# Altium schematic sheet PowerDetector.SchDoc: =ProjectName
size 420 x 297 mm; Author: SBH; CompanyName: WUT; DrawnBy: SBH; Organization: ISE-WUT; Address1: Warsaw Univeristy of Technology; Address2: Nowowiejska 15/19; Revision: -; SheetNumber: -; SheetTotal: -; EDA_Number: ARTIQ; Projet: ADC/DAC MEZZANINE; ModifiedBy: -; CreateDate: XX/XX/XXXX; CheckedDate: -; Title2: PowerDetector.SchDoc; DivGrp: ISE; Designer: SBH; ModifiedDate: -; ProjectName: ADC/DAC MEZZANINE
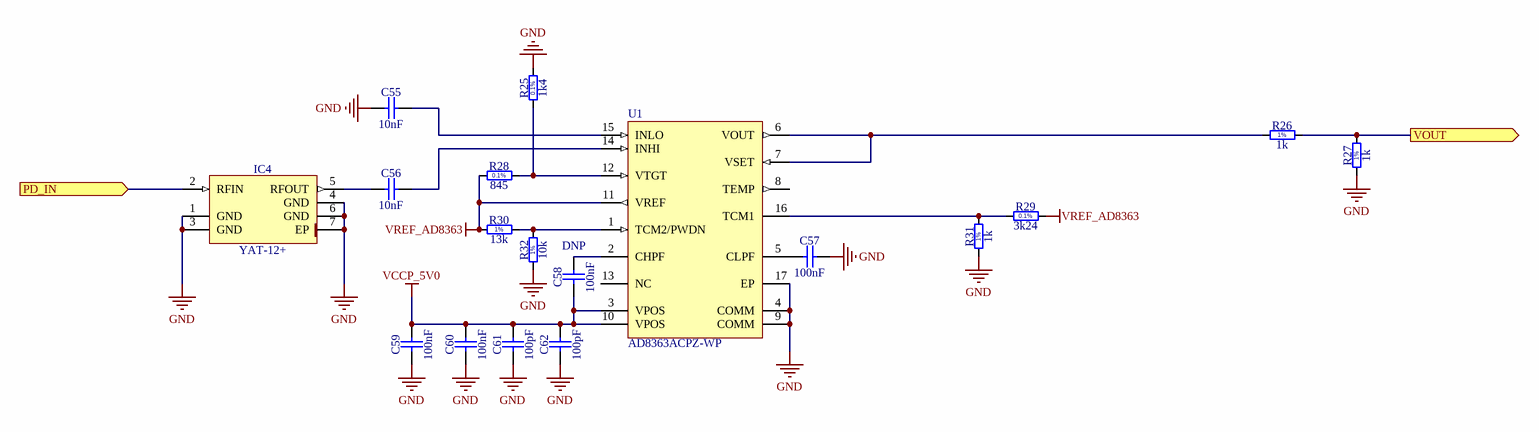
[diagram p0: PowerDetector.SchDoc]

## Parts
C55  10nF  [CAPC1005X55N]
C56  10nF  [CAPC1005X55N]
C57  100nF  [CAPC1005X55N]
C58  100nF  Mounted: DNP  [CAPC1005X55N]
C59  100nF  [CAPC1005X55N]
C60  100nF  [CAPC1005X55N]
C61  100pF  [CAPC1005X55N]
C62  100pF  [CAPC1005X55N]
IC4  YAT-12+  [MINI-CIRCUITS_MC1630]
R25  1k4  [RESC1608X55N]
R26  1k  [RESC1005X40N]
R27  1k  [RESC1005X40N]
R28  845  [RESC1608X55N]
R29  3k24  [RESC1608X55N]
R30  13k  [RESC1005X40N]
R31  1k  [RESC1005X40N]
R32  10k  [RESC1005X40N]
U1  AD8363ACPZ-WP  [ADI-CP-16-10_M]

## Ports
PD_IN (in), VOUT (out)

## Nets
GND: C55.1 C57.2 C59.1 C60.1 C61.2 C62.2 IC4.1(GND) IC4.3(GND) IC4.4(GND) IC4.6(GND) IC4.7(EP) R25.2 R27.1 R31.1 R32.1 U1.4(COMM) U1.9(COMM) U1.17(EP)
VCCP_5V0: C58.1 C59.2 C60.2 C61.1 C62.1 U1.3(VPOS) U1.10(VPOS)
VREF_AD8363: R28.1 R29.2 R30.1 U1.11(VREF)
PD_IN: IC4.2(RFIN) ; port PD_IN
VOUT: R26.2 R27.2 ; port VOUT
NetC55_2: C55.2 U1.15(INLO)
NetC56_1: C56.1 IC4.5(RFOUT)
NetC56_2: C56.2 U1.14(INHI)
NetC57_1: C57.1 U1.5(CLPF)
NetC58_2: C58.2 U1.2(CHPF)
NetR25_1: R25.1 R28.2 U1.12(VTGT)
NetR26_1: R26.1 U1.6(VOUT) U1.7(VSET)
NetR29_1: R29.1 R31.2 U1.16(TCM1)
NetR30_2: R30.2 R32.2 U1.1(TCM2/PWDN)

Not connected (* = marked no-connect by the designer): U1 8(TEMP) 13(NC)

## Notes on the sheet
- Project/Equipment
- Document
- Designer
- Drawn by
- Check.by
- File
- Last Mod.
- Print Date
- Sheet
- Size
- A3
- of
- Rev
- (in symbol R0402_1K_1%_0.0625W_100PPM) 1%
- (in symbol R0402_10K_1%_0.0625W_100PPM) 1%
- (in symbol R0402_13K_1%_0.0625W_100PPM) 1%
- (in symbol R0603_1K4_0.1%_0.063W_10PPM) 0.1%
- (in symbol R0603_3K24_0.1%_0.063W_10PPM) 0.1%
- (in symbol R0603_845R_0.1%_0.063W_10PPM) 0.1%

## Library data of the parts
C55 C56 = CC0402_10NF_16V_10%_X7R: Non-polarised capacitor; Part Description: SMD Multilayer Chip Ceramic Capacitor; Manufacturer: GENERIC; Manufacturer1 Part Number: 223878715636; Voltage: 16V; TC: X7R; Tolerance: ±10%; Part Number: CC0402_10NF_16V_10%_X7R; Component Kind: Standard; Component Type: Standard; Pin Count: 2; Value: 10nF; Status: Not Recommended; Manufacturer Part Number: CC0402_10NF_16V_10%_X7R; Case: 0402; Mounted: Yes; Socket: No; SMD: Yes; Sense: No; Manufacturer1 Example: PHYCOMP; Manufacturer1 ComponentHeight: 0.55mm; HelpURL: \\cern.ch\dfs\Applications\Altium\Datasheets\CC0402_X7R_PHYCOMP.pdf; Author: CERN DEM JLC; CreateDate: 2007-12-03; LatestRevisionDate: 2007-12-03
C57-C60 = CC0402_100NF_16V_10%_X5R: Non-polarised capacitor; Part Description: SMD Multilayer Chip Ceramic Capacitor; Manufacturer: GENERIC; Manufacturer1 Part Number: GRM155R61C104KA88D; Voltage: 16V; TC: X5R; Tolerance: ±10%; Part Number: CC0402_100NF_16V_10%_X5R; Component Kind: Standard; Component Type: Standard; Pin Count: 2; Value: 100nF; Status: None; Manufacturer Part Number: CC0402_100NF_16V_10%_X5R; Case: 0402; Socket: No; SMD: Yes; Sense: No; Manufacturer1 Example: MURATA; Manufacturer1 ComponentHeight: 0.55mm; HelpURL: \\cern.ch\dfs\Applications\Altium\Datasheets\CC0402_X5R_MURATA_GRM.pdf; Author: CERN DEM JLC; CreateDate: 2013-12-10; LatestRevisionDate: 2013-12-10
  C57 C59 C60: Mounted: Yes
C61 C62 = CC0402_100PF_50V_5%_C0G: Non-polarised capacitor; Part Description: SMD Multilayer Chip Ceramic Capacitor; Manufacturer: GENERIC; Manufacturer1 Part Number: C0402C101J5GACTU; Voltage: 50V; TC: C0G/NP0; Tolerance: ±5%; Part Number: CC0402_100PF_50V_5%_C0G; Component Kind: Standard; Component Type: Standard; Pin Count: 2; Value: 100pF; Status: Preferred; Manufacturer Part Number: CC0402_100PF_50V_5%_C0G; Case: 0402; Mounted: Yes; Socket: No; SMD: Yes; Sense: No; Manufacturer1 Example: KEMET; Manufacturer1 ComponentHeight: 0.55mm; HelpURL: \\cern.ch\dfs\Applications\Altium\Datasheets\CC0805_C0G_KEMET_(Commercial Grade).pdf; Author: CERN DEM JLC; CreateDate: 2007-12-03; LatestRevisionDate: 2015-04-22
IC4 = YAT-12+: DC to 18GHz, 2W, 50 Ohm, 4dB Attenuator; Part Description: DC to 18GHz, 2W, 50 Ohms, 12dB Attenuator; Manufacturer: MINI-CIRCUITS; PressFit: No; Bonding: No; Part Number: YAT-12+; Component Kind: Standard; Component Type: Standard; Device: YAT-12+; PackageDescription: MINI-CIRCUITS MC1630 Case, 0.65mm pitch, 6 pin, 2mm X 2mm X 0.85mm H body (w/thermal tab 0.65 X 1.25mm); Manufacturer Part Number: YAT-12+; Pin Count: 7; Mounted: Yes; Socket: No; SMD: Yes; Sense: No; ComponentHeight: 0.85mm; Author: CERN DEM JLC; HelpURL: \\cern.ch\dfs\Applications\Altium\Datasheets\YAT-12+.pdf; CreateDate: 2015-04-20; LatestRevisionDate: 2015-04-20
R25 = R0603_1K4_0.1%_0.063W_10PPM: Resistor - 0.1%; Part Description: Thin Film Chip Resistor; Manufacturer: GENERIC; Manufacturer1 Part Number: RN73C1J1K4BTDF; Power: 0.063W; TC: ±10ppm; Part Number: R0603_1K4_0.1%_0.063W_10PPM; Component Kind: Standard; Component Type: Standard; Pin Count: 2; Value: 1k4; Status: Not recommended; Tolerance: ±0.1%; Manufacturer Part Number: R0603_1K4_0.1%_0.063W_10PPM; Case: 0603; Mounted: Yes; Sense: No; Socket: No; SMD: Yes; Manufacturer1 Example: TYCO HOLSWORTHY; Manufacturer1 ComponentHeight: 0.5mm; HelpURL: \\cern.ch\dfs\Applications\Altium\Datasheets\R0603_Tyco_RN73.pdf; Author: CERN DEM JLC; CreateDate: 2007-12-03; LatestRevisionDate: 2008-03-13
R26 R27 R31 = R0402_1K_1%_0.0625W_100PPM: Resistor - 1%; Part Description: General Purpose Thick Film Chip Resistor; Manufacturer: GENERIC; Manufacturer1 Part Number: 232270671002L; TC: ±100ppm/°C; Part Number: R0402_1K_1%_0.0625W_100PPM; Component Kind: Standard; Component Type: Standard; Pin Count: 2; Value: 1k; Status: Not recommended; Power: 0.0625W; Tolerance: ±1%; Manufacturer Part Number: R0402_1K_1%_0.0625W_100PPM; Case: 0402; Mounted: Yes; Sense: No; Socket: No; SMD: Yes; Manufacturer1 Example: YAGEO PHYCOMP; Manufacturer1 ComponentHeight: 0.4mm; HelpURL: \\cern.ch\dfs\Applications\Altium\Datasheets\R0402_Phycomp_RC0402.pdf; Author: CERN DEM JLC; CreateDate: 2007-12-03; LatestRevisionDate: 2012-10-17
R28 = R0603_845R_0.1%_0.063W_10PPM: Resistor - 0.1%; Part Description: Thin Film Chip Resistor; Manufacturer: GENERIC; Manufacturer1 Part Number: RN73C1J845RBTDF; Power: 0.063W; TC: ±10ppm; Part Number: R0603_845R_0.1%_0.063W_10PPM; Component Kind: Standard; Component Type: Standard; Pin Count: 2; Value: 845; Status: Not recommended; Tolerance: ±0.1%; Manufacturer Part Number: R0603_845R_0.1%_0.063W_10PPM; Case: 0603; Mounted: Yes; Sense: No; Socket: No; SMD: Yes; Manufacturer1 Example: TYCO HOLSWORTHY; Manufacturer1 ComponentHeight: 0.5mm; HelpURL: \\cern.ch\dfs\Applications\Altium\Datasheets\R0603_Tyco_RN73.pdf; Author: CERN DEM JLC; CreateDate: 2007-12-03; LatestRevisionDate: 2008-03-13
R29 = R0603_3K24_0.1%_0.063W_10PPM: Resistor - 0.1%; Part Description: Thin Film Chip Resistor; Manufacturer: GENERIC; Manufacturer1 Part Number: RN73C1J3K24BTDF; Power: 0.063W; TC: ±10ppm; Part Number: R0603_3K24_0.1%_0.063W_10PPM; Component Kind: Standard; Component Type: Standard; Pin Count: 2; Value: 3k24; Status: Not recommended; Tolerance: ±0.1%; Manufacturer Part Number: R0603_3K24_0.1%_0.063W_10PPM; Case: 0603; Mounted: Yes; Sense: No; Socket: No; SMD: Yes; Manufacturer1 Example: TYCO HOLSWORTHY; Manufacturer1 ComponentHeight: 0.5mm; HelpURL: \\cern.ch\dfs\Applications\Altium\Datasheets\R0603_Tyco_RN73.pdf; Author: CERN DEM JLC; CreateDate: 2007-12-03; LatestRevisionDate: 2008-03-13
R30 = R0402_13K_1%_0.0625W_100PPM: Resistor - 1%; Part Description: General Purpose Thick Film Chip Resistor; Manufacturer: GENERIC; Manufacturer1 Part Number: 232270671303L; TC: ±100ppm/°C; Part Number: R0402_13K_1%_0.0625W_100PPM; Component Kind: Standard; Component Type: Standard; Pin Count: 2; Value: 13k; Status: Not recommended; Power: 0.0625W; Tolerance: ±1%; Manufacturer Part Number: R0402_13K_1%_0.0625W_100PPM; Case: 0402; Mounted: Yes; Sense: No; Socket: No; SMD: Yes; Manufacturer1 Example: YAGEO PHYCOMP; Manufacturer1 ComponentHeight: 0.4mm; HelpURL: \\cern.ch\dfs\Applications\Altium\Datasheets\R0402_Phycomp_RC0402.pdf; Author: CERN DEM JLC; CreateDate: 2007-12-03; LatestRevisionDate: 2012-10-17
R32 = R0402_10K_1%_0.0625W_100PPM: Resistor - 1%; Part Description: General Purpose Thick Film Chip Resistor; Manufacturer: GENERIC; Manufacturer1 Part Number: 232270671003L; TC: ±100ppm/°C; Part Number: R0402_10K_1%_0.0625W_100PPM; Component Kind: Standard; Component Type: Standard; Pin Count: 2; Value: 10k; Status: Not recommended; Power: 0.0625W; Tolerance: ±1%; Manufacturer Part Number: R0402_10K_1%_0.0625W_100PPM; Case: 0402; Mounted: Yes; Sense: No; Socket: No; SMD: Yes; Manufacturer1 Example: YAGEO PHYCOMP; Manufacturer1 ComponentHeight: 0.4mm; HelpURL: \\cern.ch\dfs\Applications\Altium\Datasheets\R0402_Phycomp_RC0402.pdf; Author: CERN DEM JLC; CreateDate: 2007-12-03; LatestRevisionDate: 2012-10-17
U1 = CMP-0284-00043-1: 50 Hz to 6 GHz,50 dB TruPwr™ Detector, 3µs Response Time, CP-16-10, Pb-Free, 64 Tray; Supply Current: 60mA; Response Time (ns typ): 3Âµs; Output Response: Linear in dB; RF Frequency (MHz): 6GHz; Temp Stability (dB): 500mdB; Voltage Supply (V): 4.5 to 5.5; Dynamic Range (dB): 50dB; Product Description: 125Â°C Operation, Broadband; ComponentLink3Description: Package Specification; Code_JEDEC: MO-220-VGGC; ComponentLink1Description: Manufacturer URL; ComponentLink2Description: Datasheet; PackageVersion: 010606-0; PackageReference: CP-16-10; ComponentLink1URL: www.analog.com; PackageDescription: 16-Lead Lead Frame Chip Scale Package [LFCSP_VQ]; ComponentLink2URL: http://www.analog.com/static/imported-files/data_sheets/AD8363.pdf; ComponentLink3URL: http://www.analog.com/static/imported-files/packages/PKG_PDF/LFCSP(CP)/CP_16_10.pdf; DatasheetVersion: Rev. A